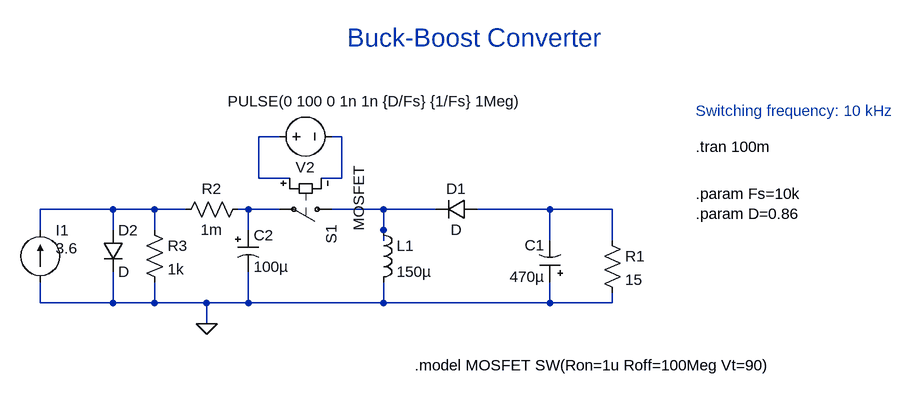
[diagram p0: schematic buck-boost-check.asc]
buck-boost-check.asc, the LTspice schematic file:
Version 4
SHEET 1 1244 680
WIRE 112 -16 80 -16
WIRE 208 -16 192 -16
WIRE 80 48 80 -16
WIRE 128 48 80 48
WIRE 208 48 208 -16
WIRE 208 48 176 48
WIRE -144 96 -256 96
WIRE -80 96 -144 96
WIRE -32 96 -80 96
WIRE 64 96 48 96
WIRE 112 96 64 96
WIRE 272 96 192 96
WIRE 352 96 272 96
WIRE 528 96 416 96
WIRE 624 96 528 96
WIRE -256 128 -256 96
WIRE -144 128 -144 96
WIRE -80 128 -80 96
WIRE 64 128 64 96
WIRE 272 128 272 96
WIRE 272 144 272 128
WIRE 528 144 528 96
WIRE 624 144 624 96
WIRE -256 240 -256 208
WIRE -144 240 -144 192
WIRE -144 240 -256 240
WIRE -80 240 -80 208
WIRE -80 240 -144 240
WIRE 0 240 -80 240
WIRE 64 240 64 192
WIRE 64 240 0 240
WIRE 272 240 272 208
WIRE 272 240 64 240
WIRE 528 240 528 208
WIRE 528 240 272 240
WIRE 624 240 624 224
WIRE 624 240 528 240
WIRE 0 272 0 240
FLAG 0 272 0
SYMBOL ind 256 112 R0
SYMATTR InstName L1
SYMATTR Value 150µ
SYMBOL res 608 128 R0
SYMATTR InstName R1
SYMATTR Value 15
SYMBOL sw 208 96 R90
WINDOW 3 -67 -26 Left 2
SYMATTR Value MOSFET
SYMATTR InstName S1
SYMBOL voltage 96 -16 M90
WINDOW 0 32 56 VTop 2
WINDOW 3 -39 164 VBottom 2
WINDOW 123 0 0 Left 0
WINDOW 39 0 0 Left 0
SYMATTR InstName V2
SYMATTR Value PULSE(0 100 0 1n 1n {D/Fs} {1/Fs} 1Meg)
SYMBOL diode 416 80 R90
WINDOW 0 0 32 VBottom 2
WINDOW 3 32 32 VTop 2
SYMATTR InstName D1
SYMBOL polcap 544 208 R180
WINDOW 0 24 57 Left 2
WINDOW 3 24 8 Left 2
SYMATTR InstName C1
SYMATTR Value 470µ
SYMBOL polcap 48 128 R0
SYMATTR InstName C2
SYMATTR Value 100µ
SYMBOL current -256 208 M180
WINDOW 0 24 80 Left 2
WINDOW 3 24 52 Left 2
WINDOW 123 0 0 Left 0
WINDOW 39 0 0 Left 0
SYMATTR InstName I1
SYMATTR Value 3.6
SYMBOL diode -160 128 R0
SYMATTR InstName D2
SYMBOL res 64 80 R90
WINDOW 0 0 56 VBottom 2
WINDOW 3 32 56 VTop 2
SYMATTR InstName R2
SYMATTR Value 1m
SYMBOL res -96 112 R0
SYMATTR InstName R3
SYMATTR Value 1k
TEXT 752 0 Left 2 !.tran 100m
TEXT 320 336 Left 2 !.model MOSFET SW(Ron=1u Roff=100Meg Vt=90)
TEXT 752 -56 Left 2 ;Switching frequency: 10 kHz
TEXT 752 72 Left 2 !.param Fs=10k\n.param D=0.86
TEXT 216 -168 Left 4 ;Buck-Boost Converter

The netlist it stands for:
* buck-boost-check.asc
L1 N005 0 150µ
R1 N006 0 15
S1 N005 N004 N001 N002 MOSFET
V2 N001 N002 PULSE(0 100 0 1n 1n {D/Fs} {1/Fs} 1Meg)
D1 N006 N005 D
C1 0 N006 470µ
C2 N004 0 100µ
I1 0 N003 3.6
D2 N003 0 D
R2 N004 N003 1m
R3 N003 0 1k
.model D D
.lib standard.dio
.tran 100m
.model MOSFET SW(Ron=1u Roff=100Meg Vt=90)
* Switching frequency: 10 kHz
.param Fs=10k
.param D=0.86
* Buck-Boost Converter
.backanno
.end